# EAGLE design littlerlights (EAGLE 7.5.0)
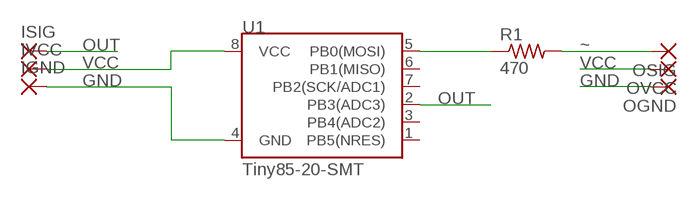
[diagram p0: schematic, sheet 1]

## Parts
IGND  SMD2  [SMD1,27-2,54]
ISIG  SMD2  [SMD1,27-2,54]
IVCC  SMD2  [SMD1,27-2,54]
OGND  SMD2  [SMD1,27-2,54]
OSIG  SMD2  [SMD1,27-2,54]
OVCC  SMD2  [SMD1,27-2,54]
R1  470  R-US_R0603  [R0603]
U1  Tiny85-20-SMT  ATTINY45TINY85-20-SMT  [SO08-EIAJ]

## Nets
GND: IGND.1(P) OGND.1(P) U1.4(GND)
MOSI: R1.1 U1.5(PB0(MOSI))
OUT: ISIG.1(P) U1.2(PB3(ADC3))
VCC: IVCC.1(P) OVCC.1(P) U1.8(VCC)
~: OSIG.1(P) R1.2
Unconnected: U1.1(PB5(NRES)) U1.3(PB4(ADC2)) U1.6(PB1(MISO)) U1.7(PB2(SCK/ADC1))

## Library data of the parts
IGND ISIG IVCC OGND OSIG OVCC = wirepad:SMD2: SMD PAD
R1 = resistor:R-US_: RESISTOR, American symbol; DIGIKEY: MCT0603-470-CFCT-ND
U1 = SparkFun-DigitalIC:ATTINY45: Atmel 8-pin 2/4/8kB flash uC; DIGIKEY: ATTINY85-20SHRCT-ND; PROD_ID: IC-09092

## Board
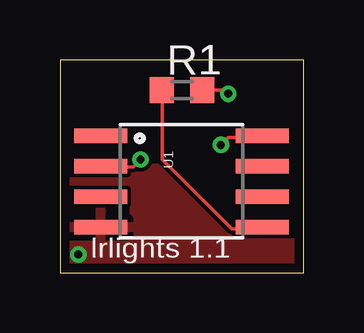
[diagram p1: board, top side]
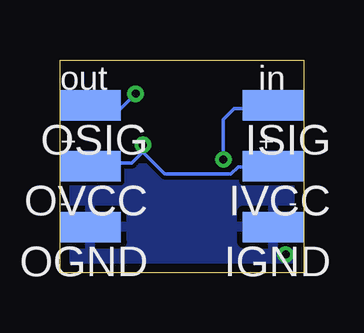
[diagram p2: board, bottom side, seen from below]

Size 10.16 x 8.88 mm. Coordinates in mm from the lower left corner, seen from the top.
Outline: 0,0 10.16,0 10.16,8.88 0,8.88 0,0
Copper layers (1*16): Top 0.0356mm / dielectric 1.5011mm / Bottom 0.0356mm
Design rules "oshpark-2layer": minimum track width 6mil, minimum drill 13mil, track to track 6mil, track to pad 6mil, pad to pad 6mil, via to via 6mil, smd to smd 6mil, copper to edge 15mil, drill to drill 6mil, minimum pad ring 7mil, minimum via ring 7mil, stop-mask expansion 4mil, vias tented up to drill 0mil, thermal gap 10mil

### Footprints (pad centres in the part's own frame; a part is rotated, then mirrored left to right if it is on the bottom)
SMD1,27-2,54 = smd 1.27 x 2.54: 1 0,0
R0603 = smd 1 x 1.1: 1 -0.85,0; 2 0.85,0
SO08-EIAJ = smd 0.61 x 2.21: 1 -1.905,-3.378; 2 -0.635,-3.378; 3 0.635,-3.378; 4 1.905,-3.378; 5 1.905,3.353; 6 0.635,3.353; 7 -0.635,3.353; 8 -1.905,3.353

### Placement (x,y rotation side)
IGND  1.27,1.91 90 bottom
ISIG  1.27,6.99 90 bottom
IVCC  1.27,4.45 90 bottom
OGND  8.89,1.91 90 bottom
OSIG  8.89,6.99 90 bottom
OVCC  8.89,4.45 90 bottom
R1  5.08,7.62 0 top
U1  5.08,3.81 270 top

### Tracks (layer width: path | path; a pad name or v marks a point on that pad's centre or on a via)
GND  (via drill 0.33)
  other vias: 0.76,0.76
  pour Bottom: 0,0 10.16,0 10.16,8.89 0,8.89
  pour Top: 0,8.89 0,0 10.16,0 10.16,8.89
MOSI
  Top 0.152: R1.1 4.27,7.62 4.27,4.72 7.16,1.83 8.38,1.83 U1.5
OUT  (via drill 0.33)
  Top 0.152: v3.35,4.72 3.05,4.42 1.83,4.42 U1.2
  Bottom 0.152: v3.35,4.72 3.35,6.4 2.9,6.86 1.37,6.86 ISIG.1
VCC  (via drill 0.33)
  Top 0.152: v6.71,5.33 7.01,5.64 8.38,5.64 U1.8
  Bottom 0.152: 6.71,5.03 7.16,4.57 8.84,4.57 OVCC.1 | 6.71,5.03 5.79,4.12 3.05,4.12 2.74,4.42 1.37,4.42 IVCC.1 | 6.71,5.03 v6.71,5.33
~  (via drill 0.33)
  Top 0.152: R1.2 6.86,7.62 v7.01,7.47
  Bottom 0.152: v7.01,7.47 7.62,6.86 8.84,6.86 OSIG.1

### Text on the board
tPlace: lrlights 1.1
bPlace: in | out | + | + | - | -